# EAGLE design esp8266-board (EAGLE 7.6.0)
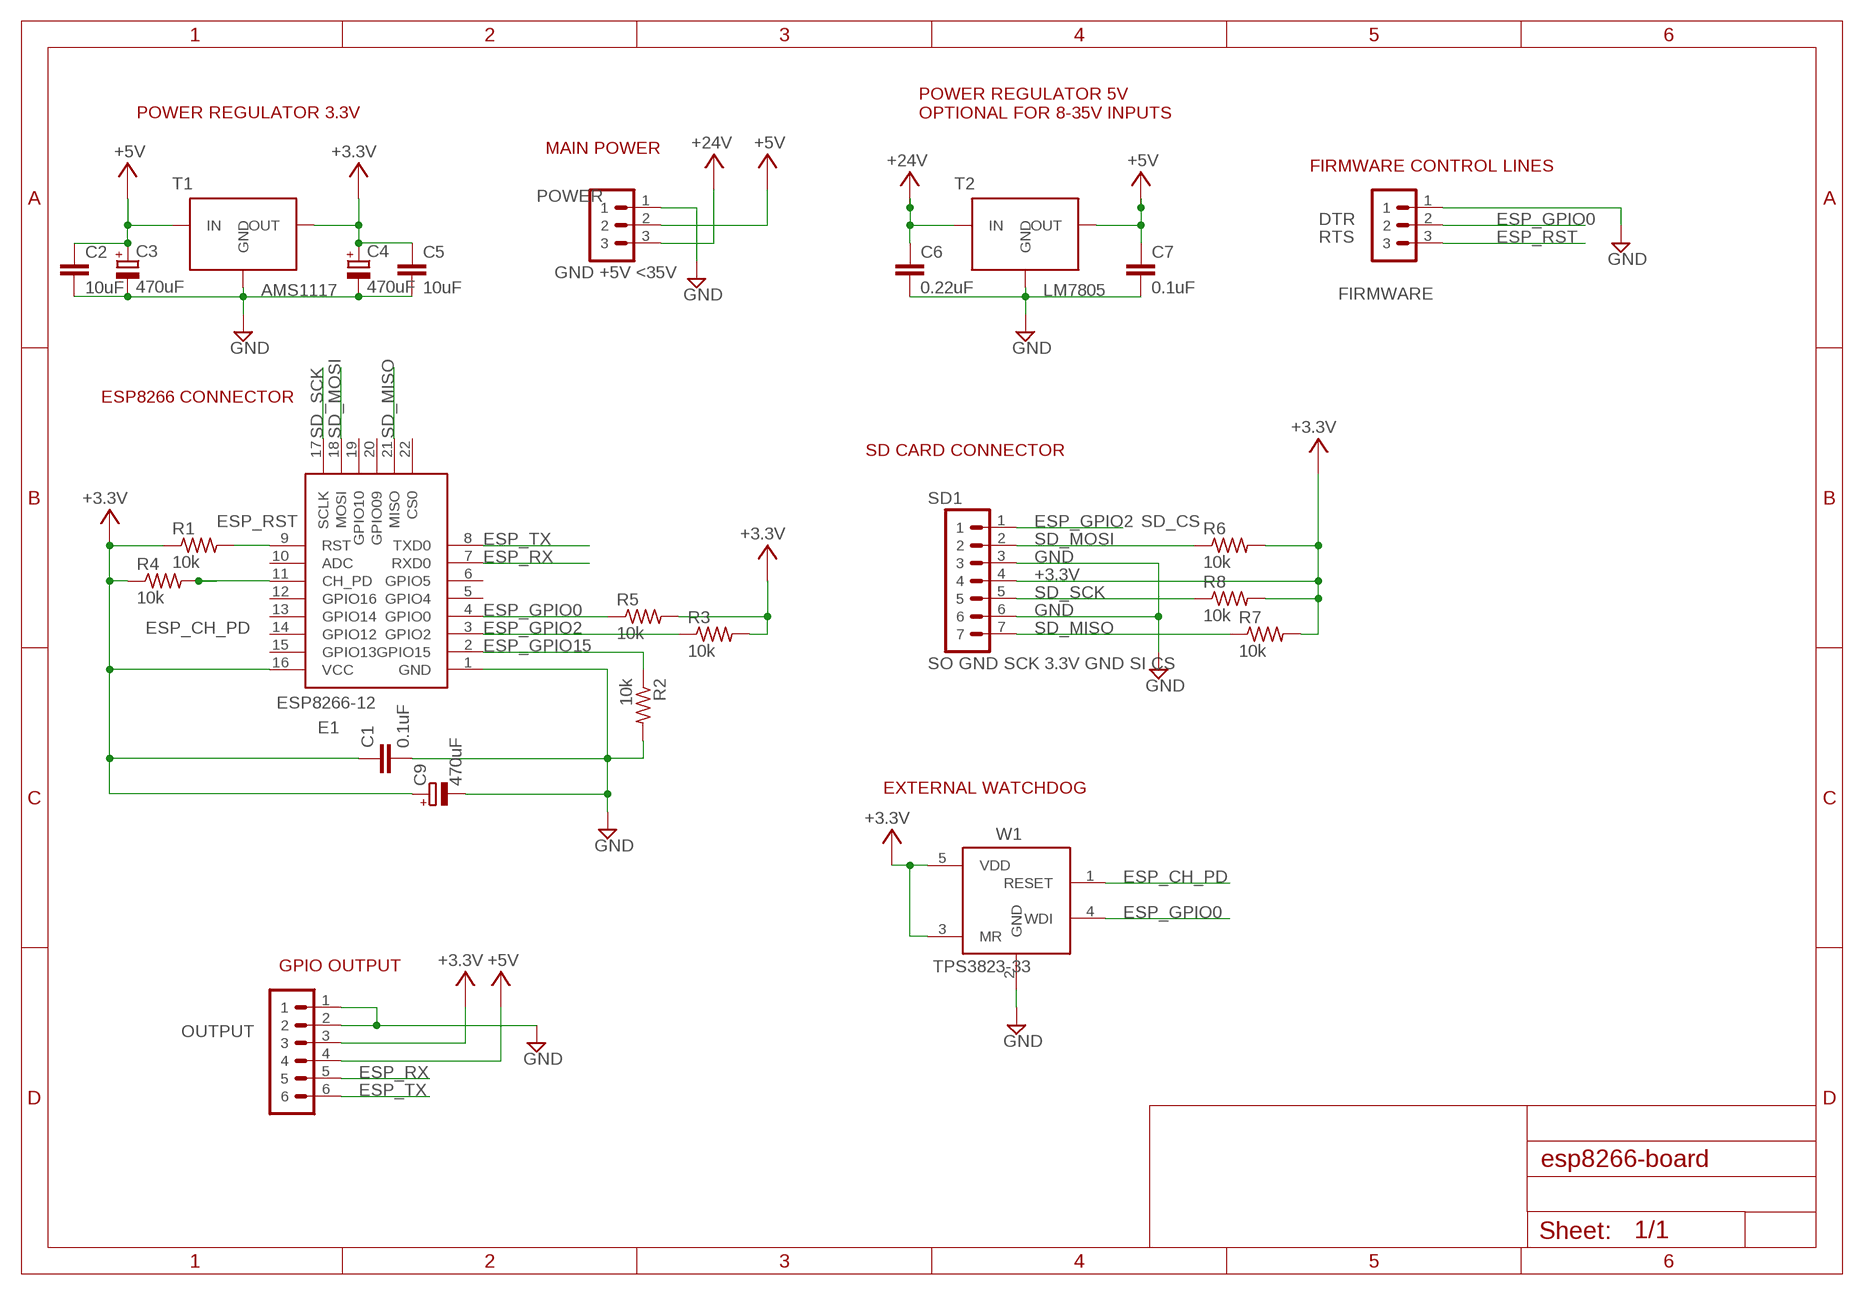
[diagram p0: schematic, sheet 1]

## Parts
C1  0.1uF  C2.5/2  [C2.5-2]
C2  10uF  C2.5/2  [C2.5-2]
C3  470uF  CPOL-EUE2,5-6E  [E2,5-6E]
C4  470uF  CPOL-EUE2,5-6E  [E2,5-6E]
C5  10uF  C2.5/2  [C2.5-2]
C6  0.22uF  C2.5/2  [C2.5-2]
C7  0.1uF  C2.5/2  [C2.5-2]
C9  470uF  CPOL-EUE2.5-6  [E2,5-6]
E1  ESP8266-12  [ESP8266-12]
FIRMWARE  GND DTR RTS  PIN-HEADER-3PIN  [PIN-HEADER-3PIN]
OUTPUT  GND GND 3.3V 5V RX TX  PIN-HEADER-6PIN  [PIN-HEADER-6PIN]
POWER  GND +5V <35V  PIN-HEADER-3PIN  [PIN-HEADER-3PIN]
R1  10k  RESISTORV1  [RESISTOR-V1]
R2  10k  RESISTORV1  [RESISTOR-V1]
R3  10k  RESISTORV1  [RESISTOR-V1]
R4  10k  RESISTORV1  [RESISTOR-V1]
R5  10k  RESISTORV1  [RESISTOR-V1]
R6  10k  RESISTORV1  [RESISTOR-V1]
R7  10k  RESISTORV1  [RESISTOR-V1]
R8  10k  RESISTORV1  [RESISTOR-V1]
SD1  SO GND SCK 3.3V GND SI CS  PIN-HEADER-7PIN  [PIN-HEADER-7PIN]
T1  AMS1117  [SOT-223]
T2  LM7805  [TO-220]
W1  TPS3823-33  TPS382X  [SOT23-5/TSOT25]

## Nets
+3.3V [power-1.7A]: C1.1 C4.+ C5.1 C9.+ E1.16(VCC) OUTPUT.3 R1.1 R3.2 R4.1 R5.2 R6.2 R7.2 R8.2 SD1.4 T1.2(OUT) W1.3(MR) W1.5(VDD)
+5V [power-1.7A]: C2.1 C3.+ C7.1 OUTPUT.4 POWER.2 T1.3(IN) T2.OUTPUT(OUT)
+24V [power-1.7A]: C6.1 POWER.3 T2.INPUT(IN)
ESP_CH_PD: E1.11(CH_PD) R4.2 W1.1(RESET)
ESP_GPIO0: E1.4(GPIO0) FIRMWARE.2 R5.1 W1.4(WDI)
ESP_GPIO2: E1.3(GPIO2) R3.1 SD1.1
ESP_GPIO15: E1.2(GPIO15) R2.1
ESP_RST: E1.9(RST) FIRMWARE.3 R1.2
ESP_RX: E1.7(RXD0) OUTPUT.5
ESP_TX: E1.8(TXD0) OUTPUT.6
GND [power-1.7A]: C1.2 C2.2 C3.- C4.- C5.2 C6.2 C7.2 C9.- E1.1(GND) FIRMWARE.1 OUTPUT.1 OUTPUT.2 POWER.1 R2.2 SD1.3 SD1.6 T1.1(GND) T2.GND W1.2(GND)
SD_MISO: E1.21(MISO) R7.1 SD1.7
SD_MOSI: E1.18(MOSI) R6.1 SD1.2
SD_SCK: E1.17(SCLK) R8.1 SD1.5
Unconnected: E1.5(GPIO4) E1.10(ADC) E1.12(GPIO16) E1.13(GPIO14) E1.14(GPIO12) E1.15(GPIO13) E1.19(GPIO10) E1.20(GPIO09) E1.22(CS0)

## Notes on the sheet
- POWER REGULATOR 3.3V
- POWER REGULATOR 5V
  OPTIONAL FOR 8-35V INPUTS
- MAIN POWER
- FIRMWARE CONTROL LINES
- DTR
- RTS
- ESP8266 CONNECTOR
- SD CARD CONNECTOR
- SD_CS
- EXTERNAL WATCHDOG
- GPIO OUTPUT

## Power pins joined to a net without a drawn wire
GPIO5: E1.6(GPIO5)

## Library data of the parts
C1 C2 C5 = capacitor-wima:C: CAPACITOR naming: grid - package width
C3 C9 = rcl:CPOL-EU: POLARIZED CAPACITOR, European symbol
C4 = rcl:CPOL-EU: POLARIZED CAPACITOR, European symbol; MPN: FK18X5R0J106M
C6 = capacitor-wima:C: CAPACITOR naming: grid - package width; MPN: 1C10Z5U104M050B
C7 = capacitor-wima:C: CAPACITOR naming: grid - package width; MPN: FK18X5R0J106M
E1 = stutz-eagle:ESP8266-12
FIRMWARE POWER = stutz-eagle:PIN-HEADER-3PIN
OUTPUT = stutz-eagle:PIN-HEADER-6PIN
R1-R8 = stutz-components-library:RESISTOR
SD1 = stutz-eagle:PIN-HEADER-7PIN
T1 = stutz-eagle:AMS1117; MPN: LM2937ET-3.3
T2 = stutz-components-library:LM7805; MPN: LM2937ET-3.3
W1 = stutz-eagle:TPS382X

## Net classes
0 default: clearance 0.355 mm
1 power-4A: width 2.642 mm
2 comm-rs485: width 1.016 mm
3 power-2A: width 1.143 mm
4 power-1.7A: width 0.8 mm

## Board
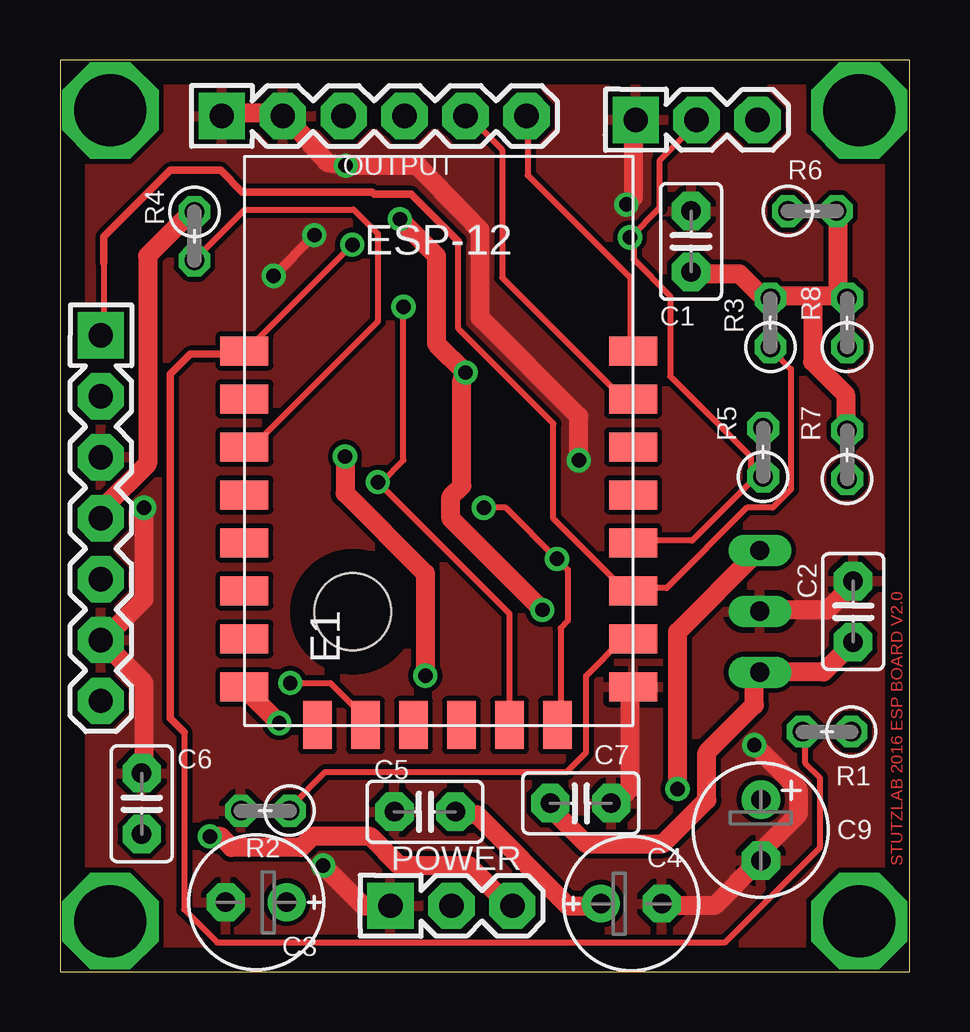
[diagram p1: board, top side]
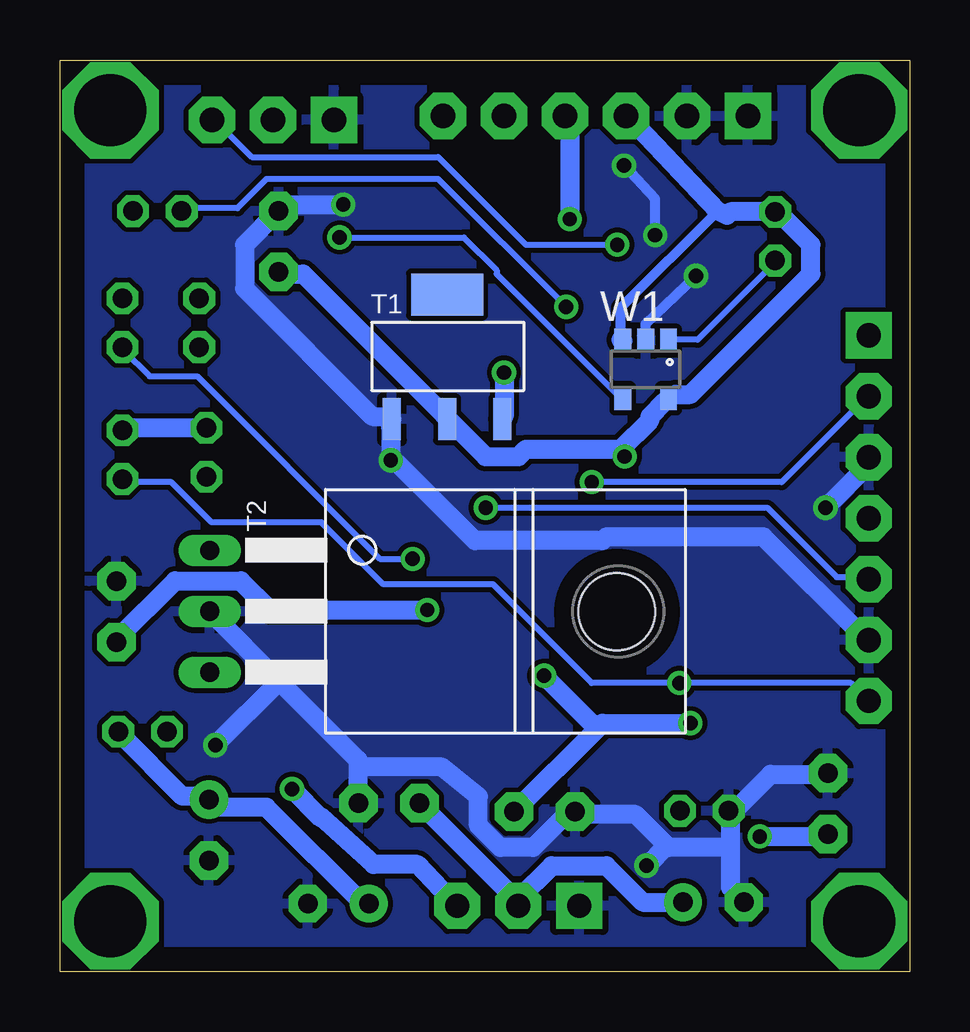
[diagram p2: board, bottom side, seen from below]

Size 35.4 x 38 mm. Coordinates in mm from the lower left corner, seen from the top.
Outline: 0,0 35.4,0 35.4,38 0,38 0,0
Copper layers (1*16): Top 0.035mm / dielectric 1.5mm / Bottom 0.035mm
Design rules "default": minimum track width 10mil, minimum drill 0.6mm, track to track 8mil, track to pad 8mil, pad to pad 8mil, via to via 8mil, smd to smd 8mil, copper to edge 40mil, drill to drill 8mil, minimum pad ring 10mil, minimum via ring 8mil, stop-mask expansion 4mil, vias tented up to drill 0mil, thermal gap 10mil
Holes 3.2 mm at 12.2,15

### Footprints (pad centres in the part's own frame; a part is rotated, then mirrored left to right if it is on the bottom)
C2.5-2 = drill 0.813 pad 1.6 octagon: 1 -1.27,0; 2 1.27,0
E2,5-6E = drill 0.813 pad 1.575: + -1.27,0 | drill 0.813 pad 1.575 octagon: - 1.27,0
E2,5-6 = drill 0.813 pad 1.6: + -1.27,0 | drill 0.813 pad 1.6 octagon: - 1.27,0
ESP8266-12 = smd 2 x 1.2: 1 -8.58,9.43; 2 -8.58,7.43; 3 -8.58,5.43; 4 -8.58,3.43; 5 -8.58,1.43; 6 -8.58,-0.57; 7 -8.58,-2.57; 8 -8.58,-4.57; 9 7.62,-4.57; 10 7.62,-2.57; 11 7.62,-0.57; 12 7.62,1.43; 13 7.62,3.43; 14 7.62,5.43; 15 7.62,7.43; 16 7.62,9.43 | smd 1.2 x 2: 17 -5.43,11.02; 18 -3.43,11.02; 19 -1.43,11.02; 20 0.57,11.02; 21 2.57,11.02; 22 4.57,11.02
PIN-HEADER-3PIN = drill 1.016 pad 1.93 square: 1 -2.54,0 | drill 1.016 pad 1.93 octagon: 2 0,0; 3 2.54,0
PIN-HEADER-6PIN = drill 1.016 pad 1.93 square: 1 -5.08,0 | drill 1.016 pad 1.93 octagon: 2 -2.54,0; 3 0,0; 4 2.54,0; 5 5.08,0; 6 7.62,0
RESISTOR-V1 = drill 0.813 octagon: 1 -1.27,0; 2 0.762,0
PIN-HEADER-7PIN = drill 1.016 pad 1.93 square: 1 -7.62,0 | drill 1.016 pad 1.93 octagon: 2 -5.08,0; 3 -2.54,0; 4 0,0; 5 2.54,0; 6 5.08,0; 7 7.62,0
SOT-223 = smd 0.75 x 1.75: 1 -2.3,-2.6; 2 0,-2.6; 3 2.3,-2.6 | smd 3 x 1.75: 4 0,2.6
TO-220 = drill 0.8 long: GND 0,-8.89; INPUT -2.54,-8.89; OUTPUT 2.54,-8.89
SOT23-5/TSOT25 = smd 0.7 x 1: 1 0.95,1.1; 2 0,1.1; 3 -0.95,1.1; 4 -0.95,-1.3; 5 0.95,-1.3

### Placement (x,y rotation side)
C1  26.29,30.44 90 top
C2  33.05,15 90 top
C3  8.18,2.89 180 top
C4  23.8,2.83 0 top
C5  15.21,6.66 180 top
C6  3.41,6.99 90 top
C7  21.7,7.02 0 top
C9  29.2,5.9 270 top
E1  15.3,21.3 180 top
FIRMWARE  26.53,35.5 0 top
OUTPUT  11.82,35.66 0 top
POWER  16.31,2.74 0 top
R1  31.7,10 180 top
R2  8.3,6.7 180 top
R3  29.6,27.3 90 top
R4  5.6,30.4 270 top
R5  29.3,21.9 90 top
R6  31.6,31.7 0 top
R7  32.8,21.8 90 top
R8  32.8,27.3 90 top
SD1  1.7,18.9 270 top
T1  19.27,25.62 0 bottom
T2  20.27,15.02 270 bottom
W1  11,25.2 0 bottom

### Tracks (layer width: path | path; a pad name or v marks a point on that pad's centre or on a via)
+3.3V  (via drill 0.6)
  Top 0.8: v9.13,10.35 7.76,11.72 E1.16 | C4.+ 22.53,2.74 21.16,2.74 17.36,6.55 16.59,6.55 C5.1 | SD1.4 1.83,19.03 1.83,19.34 3.65,21.16 3.65,29.84 5.48,31.67 R4.1 | 31.36,28.17 32.73,28.17 R8.2 32.43,28.47 32.43,31.67 R6.2 | 31.36,28.17 29.69,28.17 R3.2 29.23,28.17 28.32,29.08 26.34,29.08 C1.1 | 31.36,28.17 31.36,25.43 32.73,24.05 32.73,22.68 R7.2 | v15.22,12.33 15.22,16.59 11.88,19.95 v11.88,21.47
  Bottom 0.406: 12.03,26.34 12.03,27.67 8,31.7
  Bottom 0.8: R1.1 32.89,9.9 30.3,7.31 29.23,7.31 C9.+ 28.93,6.85 26.8,6.85 22.68,2.74 C4.+ | v9.13,10.35 12.79,10.35 13.02,10.12 | 13.02,10.12 16.44,6.7 C5.1 | 12.03,26.34 W1.3 | OUTPUT.3 11.72,35.63 8,31.7 7.61,31.52 7.46,31.67 5.63,31.67 R4.1 5.33,31.52 4.11,30.3 4.11,29.08 9.13,24.05 9.74,24.05 W1.5 10.2,23.75 10.81,23.14 10.81,22.99 12.03,21.77 | 12.03,21.77 15.99,21.77 16.29,21.47 17.66,21.47 19.18,22.99 T1.2 19.49,23.29 25.27,29.08 26.19,29.08 C1.1 | R5.2 29.38,22.68 32.73,22.68 R7.2 | v15.22,12.33 13.02,10.12 | v11.88,21.47 12.03,21.77
+5V  (via drill 0.6)
  Top 0.8: v14.16,31.36 15.68,29.84 15.68,26.19 v16.9,24.97 16.75,24.66 16.75,20.25 16.29,19.79 16.29,18.88 v20.1,15.07 | C2.1 33.04,13.7 31.82,12.48 29.23,12.48 T2.OUTPUT 28.93,12.18 28.93,11.11 26.95,9.13 26.95,7.16 25.12,5.33 21.92,5.33 20.55,6.7 C7.1
  Bottom 0.8: v16.9,24.97 16.9,23.14 T1.3 | v14.16,31.36 14.16,35.47 14.31,35.63 OUTPUT.4 | C3.+ 11.11,2.89 12.64,4.42 14.92,4.42 16.29,3.04 16.29,2.74 POWER.2 16.59,3.2 20.1,6.7 20.4,6.7 C7.1 | v20.1,15.07 26.64,15.07 27.86,16.29 30.6,16.29 33.04,13.86 C2.1
+24V  (via drill 0.6)
  Top 0.8: v25.73,7.61 25.73,14.16 29.08,17.51 T2.INPUT | v6.24,5.63 6.7,5.63 7.16,5.18 10.05,5.18 10.51,5.63 12.94,5.63 14.16,4.42 17.05,4.42 18.73,2.74 POWER.3
  Bottom 0.8: v25.73,7.61 24.51,6.39 24.51,6.44 22.33,4.46 20.5,4.46 18.88,2.74 POWER.3 | v6.24,5.63 3.5,5.63 C6.1
ESP_CH_PD
  Top 0.254: E1.11 7.76,21.92 8.07,21.92 13.25,27.1 13.25,30.75 12.24,31.76 7.71,31.76 5.63,29.69 R4.2
  Bottom 0.254: W1.1 10.05,26.34 8.83,26.34 5.63,29.54 R4.2
ESP_GPIO0  (via drill 0.6)
  Top 0.254: E1.4 23.9,17.96 26.34,17.96 28.93,20.55 29.23,20.55 R5.1 28.77,20.55 28.77,21.47 25.43,24.82 25.43,28.17 23.9,29.69 23.9,30.6 v23.75,30.6 24.97,31.82 24.97,33.8 26.64,35.47 FIRMWARE.2
  Bottom 0.254: v23.75,30.6 18.57,30.6 17.2,29.23 17.2,29.08 12.03,23.9 W1.4
ESP_GPIO2
  Top 0.254: R3.1 29.69,25.88 30.45,25.12 30.45,20.1 29.69,19.34 28.62,19.34 25.27,15.99 23.9,15.99 E1.3 23.75,15.99 23.45,15.99 20.55,18.88 20.55,22.84 16.59,26.8 16.59,30.45 | 1.83,29.54 1.83,26.64 SD1.1
  Top 0.305: 16.59,30.45 14.64,32.4 13.1,32.4 13,32.5 7.6,32.5 6.7,33.4 4.6,33.4 1.83,30.63 1.83,29.54
ESP_GPIO15
  Top 0.254: E1.2 23.75,13.86 23.45,13.86 21.92,12.33 21.92,9.13 21.11,8.32 11.06,8.32 9.59,6.85 R2.1
ESP_RST  (via drill 0.6)
  Top 0.254: v12.18,30.3 7.76,25.88 E1.9 7.61,25.73 7.16,25.73 | 5.18,9.97 5.18,2.59 6.55,1.22 27.71,1.22 31.67,5.18 31.67,8.07 31.06,8.68 31.06,9.9 R1.2
  Top 0.305: 7.16,25.73 5.43,25.73 4.6,24.9 4.6,10.54 5.18,9.97
  Bottom 0.254: v12.18,30.3 15.99,30.3 19.64,33.95 27.41,33.95 28.93,35.47 FIRMWARE.3
ESP_RX
  Top 0.254: E1.7 23.75,23.9 23.45,23.9 18.42,28.93 18.42,34.26 17.05,35.63 OUTPUT.5
ESP_TX
  Top 0.254: E1.8 23.75,25.88 23.75,28.93 19.49,33.19 19.49,35.63 OUTPUT.6
GND  (via drill 0.6)
  Top 0.406: v8.9,29 v10.6,30.7
  Top 0.8: OUTPUT.1 6.85,35.78 9.13,35.78 OUTPUT.2 9.59,35.47 11.17,33.7 v11.9,33.6 14.92,33.6 17.51,30.91 17.51,27.25 21.62,23.14 v21.62,21.32 | v23.6,31.97 23.9,32.28 23.9,35.47 FIRMWARE.1 | C4.- 25.12,2.74 27.25,2.74 29.08,4.57 C9.- 29.23,5.02 30.75,6.55 30.75,7.61 v28.93,9.44 | E1.1 23.75,11.72 23.75,7.61 22.99,6.85 C7.2 | T2.GND 29.23,15.07 31.97,15.07 33.04,16.14 C2.2 | C6.2 3.5,8.37 3.5,12.03 1.83,13.7 SD1.6 1.98,14.01 3.5,15.53 v3.5,19.34 | v10.96,4.42 12.64,2.74 13.7,2.74 POWER.1
  Bottom 0.406: W1.2 11,27 v8.9,29 | v10.6,30.7 10.6,32.2 v11.9,33.6
  Bottom 0.8: v23.6,31.97 26.04,31.97 C1.2 26.34,31.67 27.71,30.3 27.71,28.47 22.38,23.14 21.62,23.14 T1.1 21.62,22.68 v21.62,21.32 21.32,21.16 18.12,17.96 12.79,17.96 12.64,18.12 6.09,18.12 1.83,13.86 SD1.6 | 22.99,8.52 22.99,8.83 26.26,12.1 | 22.99,8.52 22.99,6.85 C7.2 | 26.26,12.1 29.08,14.92 T2.GND | 26.26,12.1 v28.93,9.44 | 7.46,5.18 7.46,3.5 6.85,2.89 C3.- | 7.46,5.18 7.46,6.7 R2.2 7.16,6.85 5.79,8.22 3.5,8.22 C6.2 | 10.12,5.25 10.05,5.18 7.46,5.18 | 10.12,5.25 11.42,6.55 13.86,6.55 C5.2 14.31,6.55 15.68,5.18 17.05,5.18 17.96,6.09 17.96,7.29 19.49,8.52 22.99,8.52 | v3.5,19.34 1.83,21.01 1.83,21.32 SD1.3 | 10.12,5.25 v10.96,4.42
  pour Bottom: -3.1,40 37.3,38.8 38,-1.3 -3.1,-1.3
  pour Top: -5.6,41.2 40,39.9 40.7,-2.4 -5.9,-2.5
N$2  (via drill 3)
  other vias: 33.3,35.9
N$3  (via drill 3)
  other vias: 33.3,2.1
N$4  (via drill 3)
  other vias: 2.1,2.1
N$5  (via drill 3)
  other vias: 2.1,35.9
SD_MISO  (via drill 0.6)
  Top 0.254: v9.59,12.03 11.27,12.03 12.64,10.66 12.64,10.35 E1.21
  Bottom 0.254: SD1.7 1.83,11.42 2.44,12.03 v9.59,12.03 13.25,12.03 17.36,16.14 21.92,16.14 24.51,18.73 29.08,18.73 30.75,20.4 32.73,20.4 R7.1
SD_MOSI  (via drill 0.6)
  Top 0.254: E1.18 18.73,10.35 18.73,14.92 v13.25,20.4 13.4,20.4 14.31,21.32 v14.31,27.71
  Bottom 0.254: v13.25,20.4 5.33,20.4 1.83,23.9 SD1.2 | v14.31,27.71 19.64,33.04 26.8,33.04 28.01,31.82 30.3,31.82 R6.1
SD_SCK  (via drill 0.6)
  Top 0.254: E1.17 20.86,10.35 20.86,14.31 21.16,14.62 21.16,16.75 v20.71,17.2 18.57,19.34 v17.66,19.34
  Bottom 0.254: v20.71,17.2 22.08,17.2 29.69,24.82 31.67,24.82 32.73,25.88 R8.1 | v17.66,19.34 5.94,19.34 3.04,16.44 1.83,16.44 SD1.5

### Text on the board
Top: STUTZLAB 2016 ESP BOARD V2.0